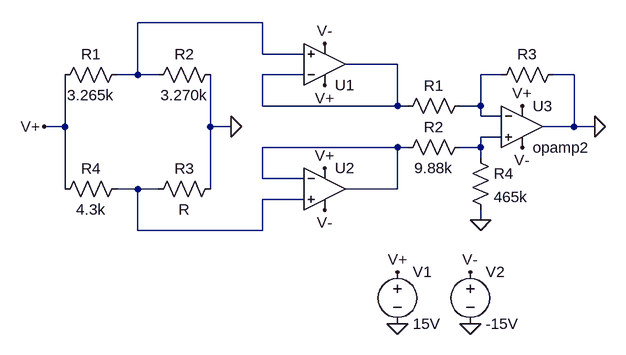
[diagram p0: schematic Vbuffer.asc]
Vbuffer.asc, the LTspice schematic file:
Version 4
SHEET 1 880 680
WIRE 16 112 -176 112
WIRE 16 160 16 112
WIRE 80 160 16 160
WIRE 224 176 144 176
WIRE -176 192 -176 112
WIRE -176 192 -208 192
WIRE -144 192 -176 192
WIRE 80 192 16 192
WIRE 384 192 352 192
WIRE 496 192 464 192
WIRE 16 240 16 192
WIRE 224 240 224 176
WIRE 224 240 16 240
WIRE 240 240 224 240
WIRE 352 240 352 192
WIRE 352 240 320 240
WIRE 352 256 352 240
WIRE 384 256 352 256
WIRE -288 272 -288 192
WIRE -288 272 -320 272
WIRE -64 272 -64 192
WIRE -32 272 -64 272
WIRE 496 272 496 192
WIRE 496 272 448 272
WIRE 528 272 496 272
WIRE 384 288 352 288
WIRE 224 304 16 304
WIRE 240 304 224 304
WIRE 352 304 352 288
WIRE 352 304 320 304
WIRE 352 320 352 304
WIRE 16 352 16 304
WIRE 80 352 16 352
WIRE -288 368 -288 272
WIRE -176 368 -208 368
WIRE -144 368 -176 368
WIRE -64 368 -64 272
WIRE 224 368 224 304
WIRE 224 368 144 368
WIRE 80 384 16 384
WIRE 352 416 352 400
WIRE -176 432 -176 368
WIRE 16 432 16 384
WIRE 16 432 -176 432
FLAG 528 272 0
FLAG 352 416 0
FLAG -32 272 0
FLAG 224 576 0
FLAG 336 576 0
FLAG 224 496 V+
FLAG -320 272 V+
FLAG 112 336 V+
FLAG 416 240 V+
FLAG 112 208 V+
FLAG 336 496 V-
FLAG 112 144 V-
FLAG 112 400 V-
FLAG 416 304 V-
SYMBOL OpAmps\\opamp2 112 240 M180
SYMATTR InstName U1
SYMATTR Value ""
SYMBOL OpAmps\\opamp2 112 304 R0
SYMATTR InstName U2
SYMATTR Value ""
SYMBOL OpAmps\\opamp2 416 208 R0
SYMATTR InstName U3
SYMBOL res -160 208 R270
WINDOW 0 32 56 VTop 2
WINDOW 3 0 56 VBottom 2
SYMATTR InstName R2
SYMATTR Value 3.270k
SYMBOL res -304 208 R270
WINDOW 0 32 56 VTop 2
WINDOW 3 0 56 VBottom 2
SYMATTR InstName R1
SYMATTR Value 3.265k
SYMBOL res -160 384 R270
WINDOW 0 32 56 VTop 2
WINDOW 3 0 56 VBottom 2
SYMATTR InstName R3
SYMBOL res -304 384 R270
WINDOW 0 32 56 VTop 2
WINDOW 3 0 56 VBottom 2
SYMATTR InstName R4
SYMATTR Value 4.3k
SYMBOL res 336 224 R90
WINDOW 0 0 56 VBottom 2
WINDOW 3 32 56 VTop 2
SYMATTR InstName R1
SYMATTR Value ""
SYMBOL res 336 288 R90
WINDOW 0 0 56 VBottom 2
WINDOW 3 32 56 VTop 2
SYMATTR InstName R2
SYMATTR Value 9.88k
SYMBOL res 480 176 R90
WINDOW 0 0 56 VBottom 2
WINDOW 3 32 56 VTop 2
SYMATTR InstName R3
SYMATTR Value ""
SYMBOL res 336 304 R0
SYMATTR InstName R4
SYMATTR Value 465k
SYMBOL voltage 224 480 R0
SYMATTR InstName V1
SYMATTR Value 15V
SYMBOL voltage 336 480 R0
SYMATTR InstName V2
SYMATTR Value -15V

The netlist it stands for:
* Vbuffer.asc
XU1 N001 N002 V+ V- N002 opamp2  ; pins In+ In- V+ V- OUT
XU2 N006 N005 V+ V- N005 opamp2  ; pins In+ In- V+ V- OUT
XU3 N004 N003 V+ V- 0 opamp2  ; pins In+ In- V+ V- OUT
R2 N001 0 3.270k
R1 V+ N001 3.265k
R3 N006 0 R
R4 V+ N006 4.3k
R1 N003 N002
R2 N004 N005 9.88k
R3 0 N003
R4 N004 0 465k
V1 V+ 0 15V
V2 V- 0 -15V
.backanno
.end